# Altium schematic sheet MaestroSwitch.SchDoc
size Tabloid
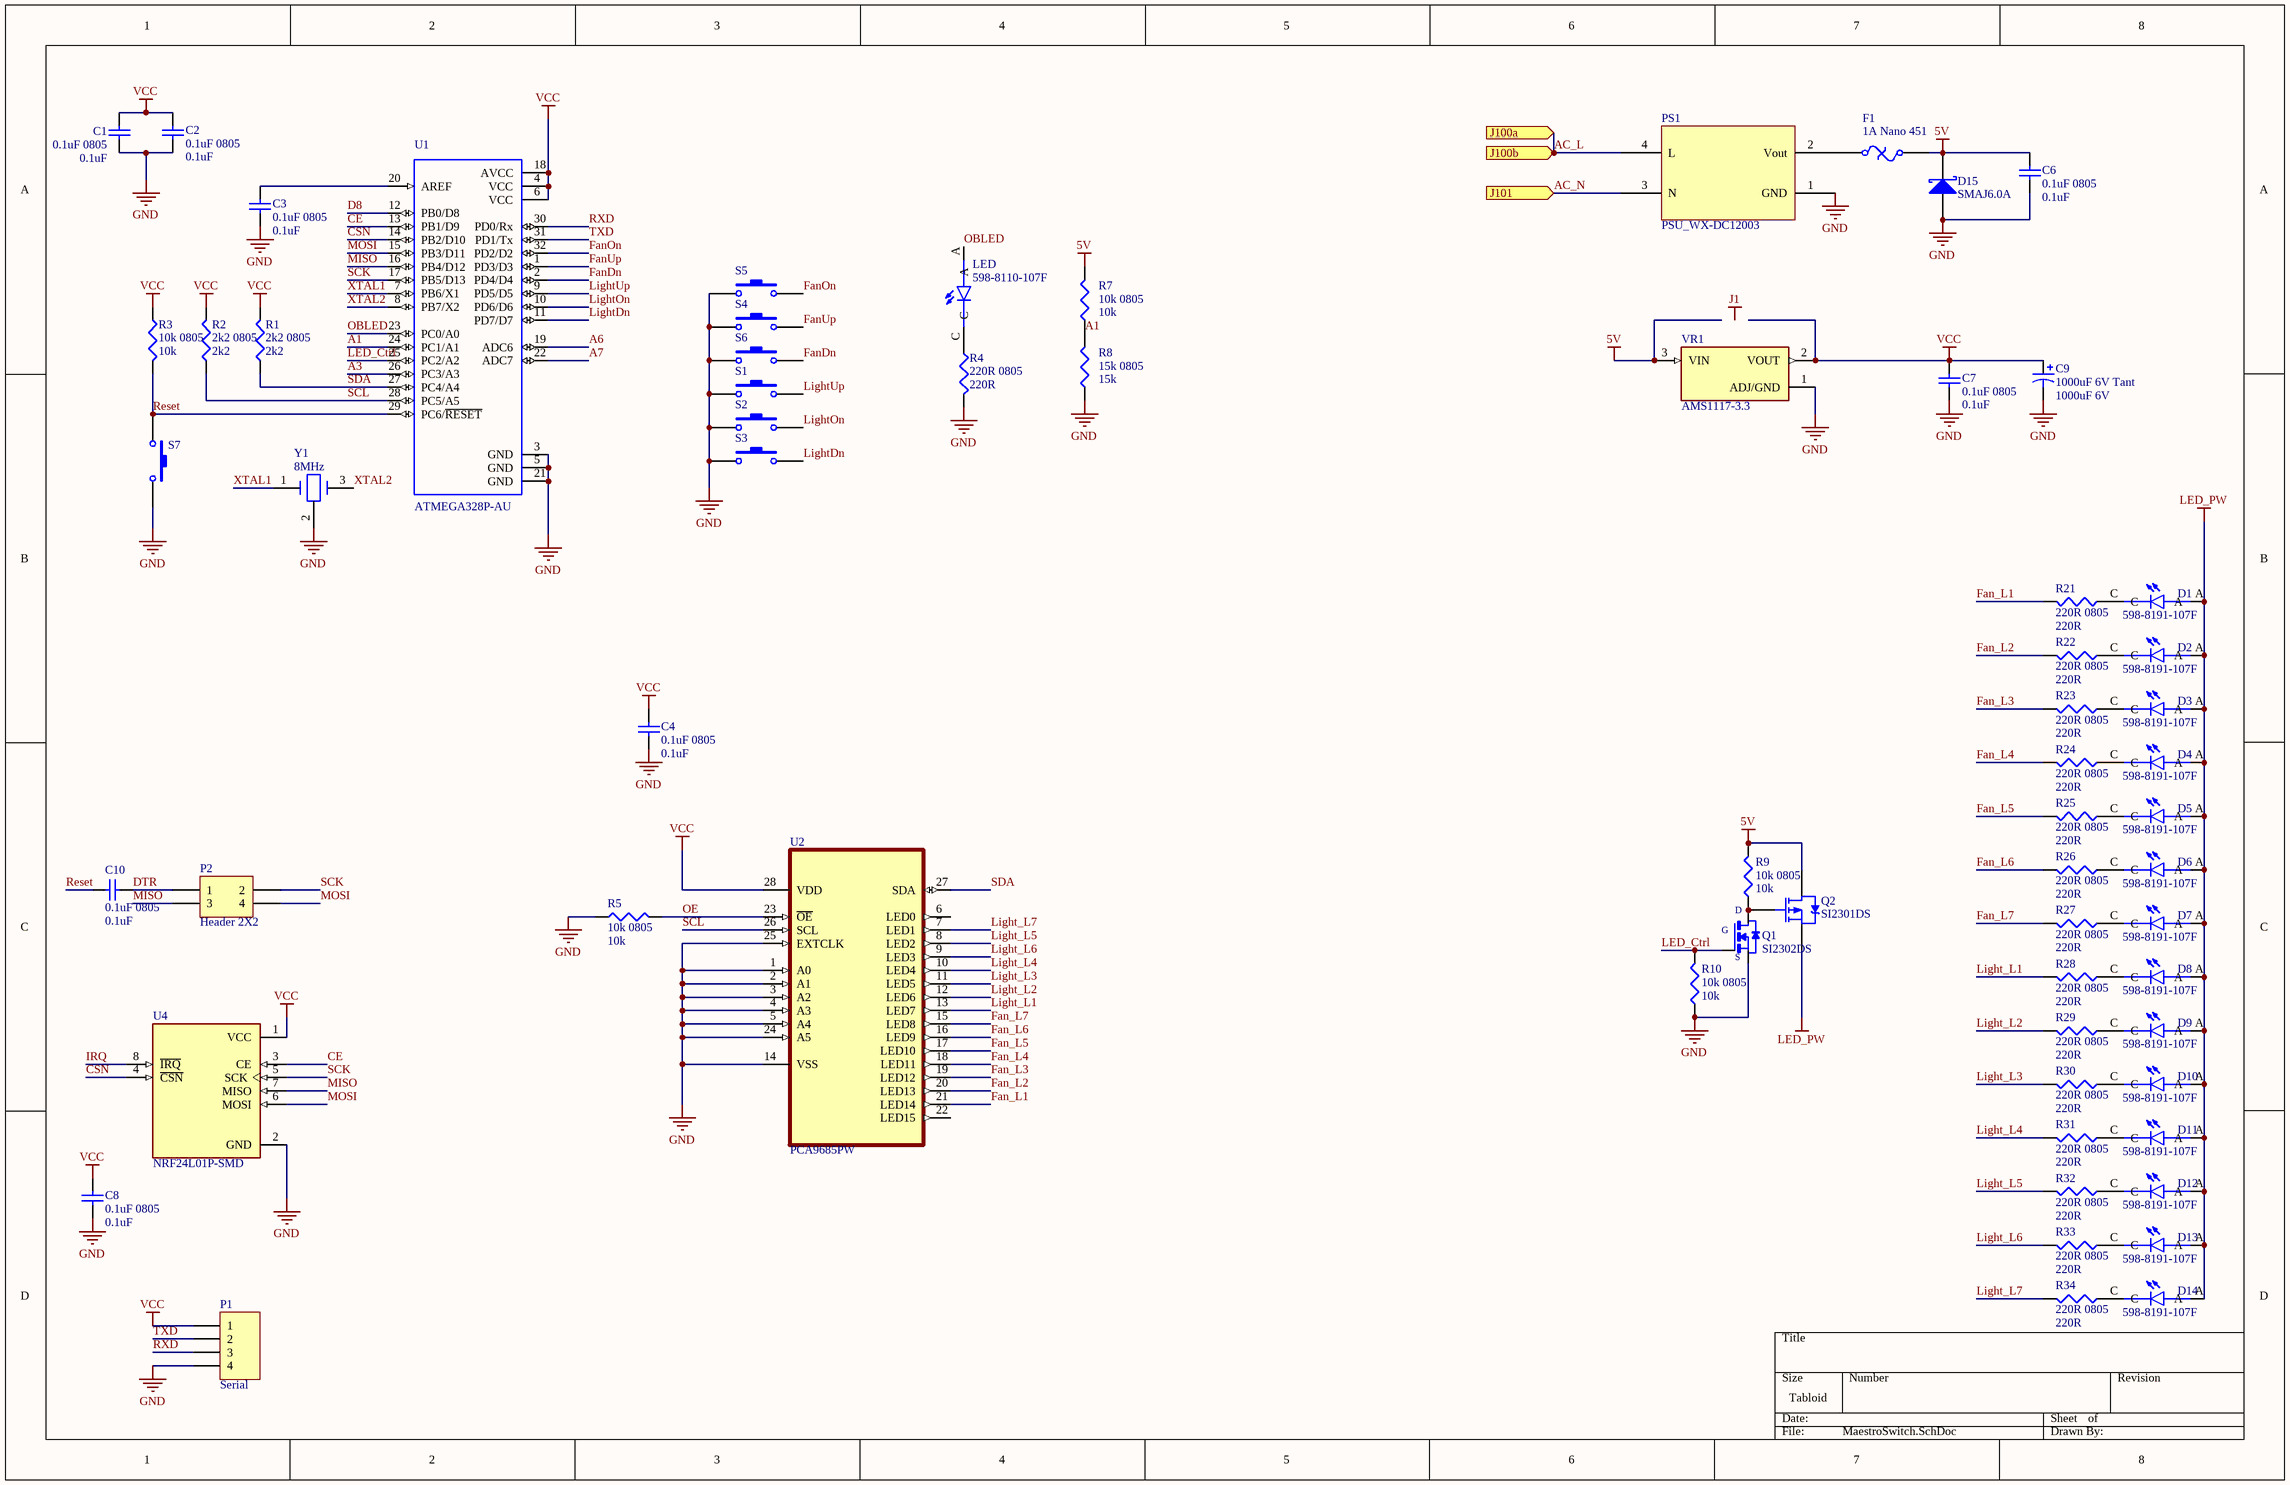
[diagram p0: MaestroSwitch.SchDoc]

## Parts
C1  0.1uF 0805  value 0.1uF  [C0805_3D]
C2  0.1uF 0805  value 0.1uF  [C0805_3D]
C3  0.1uF 0805  value 0.1uF  [C0805_3D]
C4  0.1uF 0805  value 0.1uF  [C0805_3D]
C6  0.1uF 0805  value 0.1uF  [C0805_3D]
C7  0.1uF 0805  value 0.1uF  [C0805_3D]
C8  0.1uF 0805  value 0.1uF  [C0805_3D]
C9  1000uF 6V Tant  value 1000uF 6V  [7343_Tantalum]
C10  0.1uF 0805  value 0.1uF  [C0805_3D]
D1  598-8191-107F  [LEDC2012X70N]
D2  598-8191-107F  [LEDC2012X70N]
D3  598-8191-107F  [LEDC2012X70N]
D4  598-8191-107F  [LEDC2012X70N]
D5  598-8191-107F  [LEDC2012X70N]
D6  598-8191-107F  [LEDC2012X70N]
D7  598-8191-107F  [LEDC2012X70N]
D8  598-8191-107F  [LEDC2012X70N]
D9  598-8191-107F  [LEDC2012X70N]
D10  598-8191-107F  [LEDC2012X70N]
D11  598-8191-107F  [LEDC2012X70N]
D12  598-8191-107F  [LEDC2012X70N]
D13  598-8191-107F  [LEDC2012X70N]
D14  598-8191-107F  [LEDC2012X70N]
D15  SMAJ6.0A  [DO214AC]
F1  1A Nano 451  [451 Fuse]
LED  598-8110-107F  [LEDC2012X70N]
P1  Serial  [HDR1X4]
P2  Header 2X2  [HDR2X2]
PS1  PSU_WX-DC12003  [PSU_WX-DC12003]
Q1  SI2302DS  [SOT23]
Q2  SI2301DS  [sot23]
R1  2k2 0805  value 2k2  [R0805_3D]
R2  2k2 0805  value 2k2  [R0805_3D]
R3  10k 0805  value 10k  [R0805_3D]
R4  220R 0805  value 220R  [R0805_3D]
R5  10k 0805  value 10k  [R0805_3D]
R7  10k 0805  value 10k  [R0805_3D]
R8  15k 0805  value 15k  [R0805_3D]
R9  10k 0805  value 10k  [R0805_3D]
R10  10k 0805  value 10k  [R0805_3D]
R21  220R 0805  value 220R  [R0805_3D]
R22  220R 0805  value 220R  [R0805_3D]
R23  220R 0805  value 220R  [R0805_3D]
R24  220R 0805  value 220R  [R0805_3D]
R25  220R 0805  value 220R  [R0805_3D]
R26  220R 0805  value 220R  [R0805_3D]
R27  220R 0805  value 220R  [R0805_3D]
R28  220R 0805  value 220R  [R0805_3D]
R29  220R 0805  value 220R  [R0805_3D]
R30  220R 0805  value 220R  [R0805_3D]
R31  220R 0805  value 220R  [R0805_3D]
R32  220R 0805  value 220R  [R0805_3D]
R33  220R 0805  value 220R  [R0805_3D]
R34  220R 0805  value 220R  [R0805_3D]
S1  SW-PB  [PB_SKRAAxx010]  (value not drawn)
S2  SW-PB  [PB_SKRAAxx010]  (value not drawn)
S3  SW-PB  [PB_SKRAAxx010]  (value not drawn)
S4  SW-PB  [PB_SKRAAxx010]  (value not drawn)
S5  SW-PB  [PB_SKRAAxx010]  (value not drawn)
S6  SW-PB  [PB_SKRAAxx010]  (value not drawn)
S7  SW-PB  [PB_SW_SMT2]  (value not drawn)
U1  ATMEGA328P-AU  [*QFP80P900X900X120-32N]
U2  PCA9685PW  [TSSOP-28]
U4  NRF24L01P-SMD  [NRF24L01P-SMD]
VR1  AMS1117-3.3  [SOT-223]
Y1  8MHz  [XTAL_SMT_3213]

## Ports
J100a, J100b, J101

## Nets
5V: C6.2 D15.2(K) F1.2 Q2.3(D) R7.2 R9.2 VR1.3(VIN)
GND: C1.1 C2.1 C3.1 C4.1 C6.1 C7.1 C8.1 C9.2 D15.1(A) P1.4 PS1.1(GND) Q1.2(S) R4.2 R5.1 R8.1 R10.1 S1.2 S2.2 S3.2 S4.2 S5.1 S6.1 S7.2 U1.3(GND) U1.5(GND) U1.21(GND) U2.1(A0) U2.2(A1) U2.3(A2) U2.4(A3) U2.5(A4) U2.14(VSS) U2.24(A5) U2.25(EXTCLK) U4.2(GND) VR1.1(ADJ/GND) Y1.2(GND)
LED_PW: D1.A D2.A D3.A D4.A D5.A D6.A D7.A D8.A D9.A D10.A D11.A D12.A D13.A D14.A Q2.2(S)
VCC: C1.2 C2.2 C4.2 C7.2 C8.2 C9.1 P1.1 R1.2 R2.2 R3.1 U1.4(VCC) U1.6(VCC) U1.18(AVCC) U2.28(VDD) U4.1(VCC) VR1.2(VOUT) VR1.4(VOUT)
A1: R7.1 R8.2 U1.24(PC1/A1)
A3: U1.26(PC3/A3)
A6: U1.19(ADC6)
A7: U1.22(ADC7)
AC_L: PS1.4(L) ; port J100a, port J100b
AC_N: PS1.3(N) ; port J101
CE: U1.13(PB1/D9) U4.3(CE)
CSN: U1.14(PB2/D10) U4.4(~{CSN})
D8: U1.12(PB0/D8)
DTR: C10.1 P2.1
Fan_L1: R21.2 U2.21(LED14)
Fan_L2: R22.2 U2.20(LED13)
Fan_L3: R23.2 U2.19(LED12)
Fan_L4: R24.2 U2.18(LED11)
Fan_L5: R25.2 U2.17(LED10)
Fan_L6: R26.2 U2.16(LED9)
Fan_L7: R27.2 U2.15(LED8)
FanDn: S6.2 U1.2(PD4/D4)
FanOn: S5.2 U1.32(PD2/D2)
FanUp: S4.1 U1.1(PD3/D3)
IRQ: U4.8(~{IRQ})
LED_Ctrl: Q1.1(G) R10.2 U1.25(PC2/A2)
Light_L1: R28.2 U2.13(LED7)
Light_L2: R29.2 U2.12(LED6)
Light_L3: R30.2 U2.11(LED5)
Light_L4: R31.2 U2.10(LED4)
Light_L5: R32.2 U2.8(LED2)
Light_L6: R33.2 U2.9(LED3)
Light_L7: R34.2 U2.7(LED1)
LightDn: S3.1 U1.11(PD7/D7)
LightOn: S2.1 U1.10(PD6/D6)
LightUp: S1.1 U1.9(PD5/D5)
MISO: P2.3 U1.16(PB4/D12) U4.7(MISO)
MOSI: P2.4 U1.15(PB3/D11) U4.6(MOSI)
OBLED: LED.A U1.23(PC0/A0)
OE: R5.2 U2.23(~{OE})
Reset: C10.2 R3.2 S7.1 U1.29(PC6/~{RESET})
RXD: P1.3 U1.30(PD0/Rx)
SCK: P2.2 U1.17(PB5/D13) U4.5(SCK)
SCL: R2.1 U1.28(PC5/A5) U2.26(SCL)
SDA: R1.1 U1.27(PC4/A4) U2.27(SDA)
TXD: P1.2 U1.31(PD1/Tx)
XTAL1: U1.7(PB6/X1) Y1.1(OSC1)
XTAL2: U1.8(PB7/X2) Y1.3(OSC2)
NetC3_2: C3.2 U1.20(AREF)
NetD1_C: D1.C R21.1
NetD2_C: D2.C R22.1
NetD3_C: D3.C R23.1
NetD4_C: D4.C R24.1
NetD5_C: D5.C R25.1
NetD6_C: D6.C R26.1
NetD7_C: D7.C R27.1
NetD8_C: D8.C R28.1
NetD9_C: D9.C R29.1
NetD10_C: D10.C R30.1
NetD11_C: D11.C R31.1
NetD12_C: D12.C R32.1
NetD13_C: D13.C R33.1
NetD14_C: D14.C R34.1
NetF1_1: F1.1 PS1.2(Vout)
NetLED_C: LED.C R4.1
NetQ1_3: Q1.3(D) Q2.1(G) R9.1

Not connected (* = marked no-connect by the designer): U2 6(LED0) 22(LED15)

## Notes on the sheet
- Labels drawn without touching a wire or pin: J1

## Library data of the parts
C1-C4 C6-C8 C10 = Cap: Capacitor; Published: 8-Jun-2000; LatestRevisionDate: 17-Jul-2002; LatestRevisionNote: Re-released for DXP Platform.; PackageReference: RAD-0.3; Publisher: Altium Limited; PackageDescription: Radial Cap, Thru-Hole; 2 Leads; 0.3 in Pin Spacing
C9 = Cap Pol3: Polarized Capacitor (Surface Mount); Published: 8-Jun-2000; LatestRevisionDate: 29-May-2009; LatestRevisionNote: IPC-7351 Footprint Added.; PackageReference: C0805; Publisher: Altium Limited; PackageDescription: Chip Capacitor
D1-D14 = 598-8191-107F: Blue 473nm LED Indication - Discrete 3.2V 0805 _2012 Metric_; MF: Dialight; Package: 0805 Dialight; Value: *; Availability: Unavailable; MP: 598-8191-107F; SnapEDA_Link: https://www.snapeda.com/parts/598-8191-107F/Dialight/view-part/432480/?ref=snap; Price: None
D15 = Diode 11DQ03: Schottky Rectifier; pin to pad: 1>A 2>K; Published: 8-Jun-2000; LatestRevisionDate: 17-Jul-2002; LatestRevisionNote: Re-released for DXP Platform.; DatasheetVersion: Dec-1997; PackageReference: DO-204AL; Publisher: Altium Limited; PackageDescription: Diode, Axial; Body 5.2 x 2.7 mm (LxDia. max), Lead Dia. 0.86 mm (max); Code_JEDEC: DO-204-AL; ComponentLink1Description: Manufacturer Link; ComponentLink1URL: http://www.irf.com/; ComponentLink2Description: Datasheet; ComponentLink2URL: http://www.irf.com/product-info/datasheets/data/11dq03.pdf
F1 = Fuse Thermal: 1A Nano 451 SMD 6.1x2.69mm; Published: 24-Mar-1999; LatestRevisionDate: 17-Jul-2002; LatestRevisionNote: Re-released for DXP Platform.; PackageReference: PIN-W2/E2.8; Publisher: Altium Limited; PackageDescription: Thru-Hole; 2 Leads
LED = 598-8191-107F: Red 635nm LED Indication - Discrete 2.2V 0805 _2012 Metric_; MF: Dialight; Package: 0805 Dialight; Value: *; Availability: Unavailable; MP: 598-8191-107F; SnapEDA_Link: https://www.snapeda.com/parts/598-8191-107F/Dialight/view-part/432480/?ref=snap; Price: None
P1 = Header 4: Header, 4-Pin; LatestRevisionDate: 17-Jul-2002; LatestRevisionNote: Re-released for DXP Platform.; Publisher: Altium Limited
P2 = Header 2X2: Header, 2-Pin, Dual row; LatestRevisionDate: 17-Jul-2002; LatestRevisionNote: Re-released for DXP Platform.; Publisher: Altium Limited
Q1 = SI2302DS: N-Channel 20V 2.5A _Tc_ 830mW _Tc_ Surface Mount TO-236AB _SOT23_; MF: NXP USA; Availability: Unavailable; Value: *; Price: None; SnapEDA_Link: https://www.snapeda.com/parts/SI2302DS/NXP%20USA%20Inc./view-part/767383/?ref=snap; MP: SI2302DS; Package: SOT-23-3 NXP USA
Q2 = PMOS-2: P-Channel Power MOSFET; Note: Pin 4 not drawn and electrically connected to Pin 2.; Published: 8-Jun-2000; LatestRevisionDate: 17-Jul-2002; LatestRevisionNote: Re-released for DXP Platform.; DatasheetVersion: PD-9.390D; PackageVersion: Feb-1997; PackageReference: TO-220AB; Publisher: Altium Limited; PackageDescription: TO, Thru-Hole, Vertical, Heatsink Mounted; 3 In-Line Leads; Pitch 2.54 mm; ComponentLink1Description: Manufacturer Link; ComponentLink1URL: http://www.irf.com/
R1-R5 R7-R10 R21-R34 = Res3: Resistor; Published: 8-Jun-2000; LatestRevisionDate: 29-May-2009; LatestRevisionNote: IPC-7351 Footprint Added.; PackageReference: J1-0603; Publisher: Altium Limited; PackageDescription: Chip Resistor
S1-S7 = SW-PB: Switch; Published: 24-Mar-1999; LatestRevisionDate: 17-Jul-2002; LatestRevisionNote: Re-released for DXP Platform.; PackageReference: SPST-2; Publisher: Altium Limited; PackageDescription: Switch; 2 Leads
U1 = ATMEGA328P-AU: AVR AVR® ATmega Microcontroller IC 8-Bit 20MHz 32KB _16K x 16_ FLASH 32-TQFP _7x7_; MF: Microchip; Package: TQFP-32 Microchip; Price: None; MP: ATMEGA328P-AU; Availability: Unavailable; SnapEDA_Link: https://www.snapeda.com/parts/ATMEGA328P-AU/Microchip/view-part/586529/?ref=snap; Value: *
U2 = PCA9685PW: LED Driver IC 16 Output Linear PWM Dimming 25mA 28-TSSOP; MF: NXP USA; SnapEDA_Link: https://www.snapeda.com/parts/PCA9685PW/NXP%20USA%20Inc./view-part/4219090/?ref=snap; MP: PCA9685PW; Availability: Unavailable; Package: TSSOP-28 NXP USA; Price: None; Value: *
U4 = NRF24L01P-SMD: - Transceiver For Use With nRF24L01+; MP: NRF24L01P-MODULE-PCB; MF: Nordic Semiconductor; Package: None; Value: *; Availability: Bad; Price: None; SnapEDA_Link: https://www.snapeda.com/parts/NRF24L01P-MODULE-PCB/Nordic%20Semiconductor%20ASA/view-part/230534/?ref=snap; Mouser-Purchase-URL: https://snapeda.com/shop?store=Mouser&id=230534
VR1 = AMS1117-3.3: Sot223/Pkg 1-Amp 3.3-Volt Low Drop Out Voltage Regulatator; MF: Advanced Monolithic Systems; Price: None; Package: None; Value: *; MP: AMS1117-3.3; Availability: Unavailable; SnapEDA_Link: https://www.snapeda.com/parts/AMS1117-3.3/Advanced%20Monolithic%20Systems/view-part/53450/?ref=snap
Y1 = XTAL: Crystal Oscillator; Published: 8-Jun-2000; LatestRevisionDate: 17-Jul-2002; LatestRevisionNote: Re-released for DXP Platform.; PackageReference: R38; Publisher: Altium Limited; PackageDescription: Crystal, Thru-Hole; 2 Leads; Body 3.1 x 8.2 mm (Dia.xH)